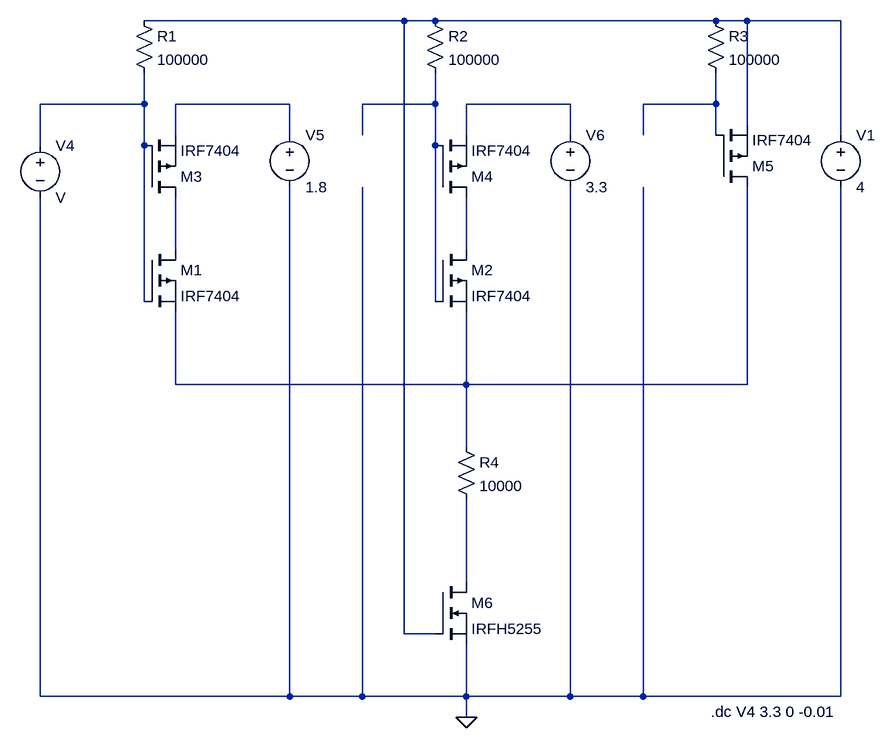
[diagram p0: schematic PPS330D.asc]
PPS330D.asc, the LTspice schematic file:
Version 4
SHEET 1 1128 948
WIRE -64 -144 -464 -144
WIRE -16 -144 -64 -144
WIRE 416 -144 -16 -144
WIRE 464 -144 416 -144
WIRE 608 -144 464 -144
WIRE -464 -16 -464 -64
WIRE -464 -16 -624 -16
WIRE -240 -16 -416 -16
WIRE -16 -16 -16 -64
WIRE -16 -16 -128 -16
WIRE 192 -16 32 -16
WIRE 416 -16 416 -64
WIRE 416 -16 304 -16
WIRE 464 16 464 -144
WIRE -416 32 -416 -16
WIRE -240 32 -240 -16
WIRE -128 32 -128 -16
WIRE 32 32 32 -16
WIRE 192 32 192 -16
WIRE 304 32 304 -16
WIRE 416 32 416 -16
WIRE 608 32 608 -144
WIRE -624 48 -624 -16
WIRE -464 48 -464 -16
WIRE -16 48 -16 -16
WIRE -416 208 -416 128
WIRE 32 208 32 128
WIRE -464 288 -464 48
WIRE -16 288 -16 48
WIRE -416 416 -416 304
WIRE 32 416 32 304
WIRE 32 416 -416 416
WIRE 464 416 464 112
WIRE 464 416 32 416
WIRE 32 512 32 416
WIRE 32 720 32 592
WIRE -64 800 -64 -144
WIRE -16 800 -64 800
WIRE -624 896 -624 128
WIRE -240 896 -240 112
WIRE -240 896 -624 896
WIRE -128 896 -128 112
WIRE -128 896 -240 896
WIRE 32 896 32 816
WIRE 32 896 -128 896
WIRE 192 896 192 112
WIRE 192 896 32 896
WIRE 304 896 304 112
WIRE 304 896 192 896
WIRE 608 896 608 112
WIRE 608 896 304 896
WIRE 32 928 32 896
FLAG 32 928 0
SYMBOL pmos -464 208 R0
SYMATTR InstName M1
SYMATTR Value IRF7404
SYMBOL pmos -16 208 R0
SYMATTR InstName M2
SYMATTR Value IRF7404
SYMBOL pmos -464 128 M180
SYMATTR InstName M3
SYMATTR Value IRF7404
SYMBOL pmos -16 128 M180
SYMATTR InstName M4
SYMATTR Value IRF7404
SYMBOL pmos 416 112 M180
SYMATTR InstName M5
SYMATTR Value IRF7404
SYMBOL res -480 -160 R0
SYMATTR InstName R1
SYMATTR Value 100000
SYMBOL res -32 -160 R0
SYMATTR InstName R2
SYMATTR Value 100000
SYMBOL res 400 -160 R0
SYMATTR InstName R3
SYMATTR Value 100000
SYMBOL voltage 608 16 R0
WINDOW 123 0 0 Left 2
WINDOW 39 0 0 Left 2
SYMATTR InstName V1
SYMATTR Value 4
SYMBOL voltage -624 32 R0
SYMATTR InstName V4
SYMBOL voltage -240 16 R0
WINDOW 123 0 0 Left 2
WINDOW 39 0 0 Left 2
SYMATTR InstName V5
SYMATTR Value 1.8
SYMBOL voltage 192 16 R0
WINDOW 123 0 0 Left 2
WINDOW 39 0 0 Left 2
SYMATTR InstName V6
SYMATTR Value 3.3
SYMBOL res 16 496 R0
SYMATTR InstName R4
SYMATTR Value 10000
SYMBOL nmos -16 720 R0
SYMATTR InstName M6
SYMATTR Value IRFH5255
TEXT 408 920 Left 2 !.dc V4 3.3 0 -0.01

The netlist it stands for:
* PPS330D.asc
M1 N007 N002 N009 N009 IRF7404
M2 N008 N004 N009 N009 IRF7404
M3 N007 N002 N003 N003 IRF7404
M4 N008 N004 N005 N005 IRF7404
M5 N009 N006 N001 N001 IRF7404
R1 N001 N002 100000
R2 N001 N004 100000
R3 N001 N006 100000
V1 N001 0 4
V4 N002 0 V
V5 N003 0 1.8
V6 N005 0 3.3
R4 N009 N010 10000
M6 N010 N001 0 0 IRFH5255
.model NMOS NMOS
.model PMOS PMOS
.lib standard.mos
.dc V4 3.3 0 -0.01
.backanno
.end